# Altium schematic sheet U_Console.SchDoc
size Letter
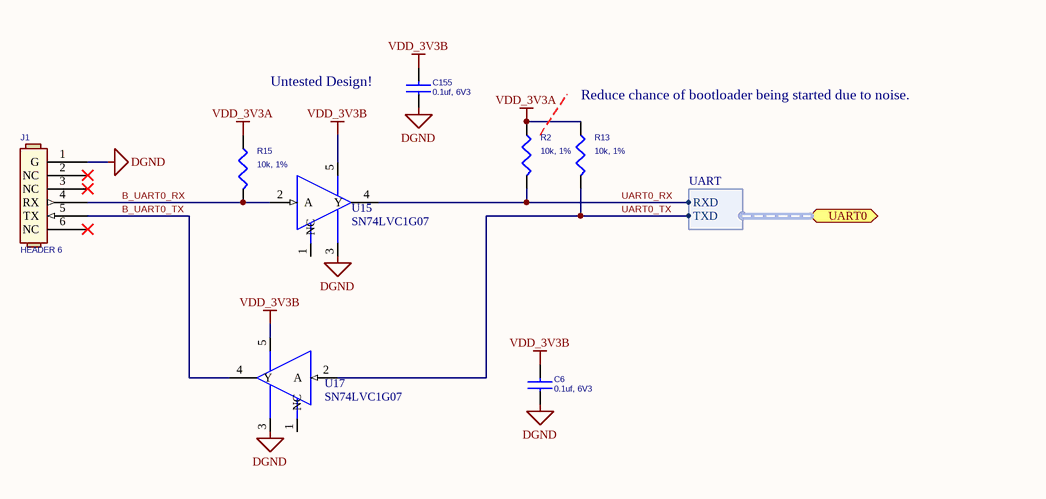
[diagram p0: U_Console.SchDoc]

## Parts
C6  0.1uf, 6V3  [402]
C155  0.1uf, 6V3  [402]
J1  HEADER 6  [SIP6]
R2  10k, 1%  [402]
R13  10k, 1%  [402]
R15  10k, 1%  [402]
U15  SN74LVC1G07  [DCK5_2P15X1P4]
U17  SN74LVC1G07  [DCK5_2P15X1P4]

## Ports
UART0 (harness UART)

## Harnesses
UART: RXD, TXD

## Nets
DGND: C6.1 C155.1 J1.1(G) U15.3(GND) U17.3(GND)
VDD_3V3A: R2.1 R13.1 R15.1
VDD_3V3B: C6.2 C155.2 U15.5(VCC) U17.5(VCC)
B_UART0_RX: J1.4(RX) R15.2 U15.2(A)
B_UART0_TX: J1.5(TX) U17.4(Y)
UART0_RX: R2.2 U15.4(Y) ; port UART0.RXD
UART0_TX: R13.2 U17.2(A) ; port UART0.TXD

Not connected (* = marked no-connect by the designer): J1 2(NC)* 3(NC)* 6(NC)*; U15 1(NC); U17 1(NC)

## Notes on the sheet
- (near C155) Untested Design!
- (near R13) Reduce chance of bootloader being started due to noise.

## Library data of the parts
C6 C155 = CAP_0.1uF_X7R_16V_10% 0402: CAP CER 0.1UF 6.3V 10% X5R 0402; Manufacturer: TDK Corporation; Manufacturer Part Number: C1005X5R0J104K050BA; Capacitance: 0.1µF; Supplier 1: Digi-Key; Supplier Part Number 1: 445-1266-6-ND; RoHS: RoHS Compliant; Category: Capacitors; Stock 1: 127604; Pricing 1: 1=0.1, 10=0.026, 100=0.0121, 250=0.00992, 500=0.00848, 1000=0.0066, 5000=0.0055 (USD); Voltage - Rated: 6.3V; Tolerance: ±10%; Temperature Coefficient: X5R; Mounting Type: Surface Mount, MLCC; Operating Temperature: -55°C ~ 85°C; Applications: General Purpose; Ratings: -; Package / Case: 0402 (1005 Metric); Size / Dimension: 0.039" L x 0.020" W (1.00mm x 0.50mm); Height - Seated (Max): -; Thickness (Max): 0.022" (0.55mm); Lead Spacing: -; Features: -; Packaging: Digi-Reel®; Lead Style: -; ComponentLink1URL: http://product.tdk.com/capacitor/mlcc/en/documents/mlcc_commercial_general_en.pdf; ComponentLink1Description: http://product.tdk.com/capacitor/mlcc/en/documents/mlcc_commercial_general_en.pdf
J1 = HDR_6x1: CONN HEADER 6POS, VERTICAL,  .100 STR TIN; Manufacturer: Samtec Inc; Manufacturer Part Number: FTR-110-03-G-D-06; Connector Type: Unshrouded; Number of Positions: 20; Number of Positions Loaded: 19; Pitch: 0.050" (1.27mm); Row Spacing: 0.100" (2.54mm); Supplier 1: Digi-Key; Supplier Part Number 1: FTR-110-03-G-D-06-ND; RoHS: RoHS Compliant; Category: Connectors, Interconnects; Stock 1: 0; Pricing 1: 1=4.47 (USD); Number of Rows: 2; Contact Mating Length: 0.125" (3.18mm); Mounting Type: Surface Mount; Termination: Solder; Features: -; Contact Finish: Gold; Contact Finish Thickness: 10µin (0.25µm); Color: Black; Packaging: Tube; ComponentLink1URL: http://www.samtec.com/documents/webfiles/cpdf/FTR-1XX-XX-XX-D-X-XX-MKT.pdf; ComponentLink1Description: http://www.samtec.com/documents/webfiles/cpdf/FTR-1XX-XX-XX-D-X-XX-MKT.pdf; Height Stacking (Mating): -; Molding Height Above Board: 0.100" (2.54mm)
R2 R13 R15 = RES_10K_1/16W_1%_0402: RES 10K OHM 1/16W 5% 0402 SMD; Manufacturer: Rohm Semiconductor; Manufacturer Part Number: MCR01MZPJ103; Power (Watts): 0.063W, 1/16W; Temperature Coefficient: ±200ppm/°C; Category: Resistors; ComponentLink1Description: http://rohmfs.rohm.com/en/products/databook/datasheet/passive/resistor/chip_resistor/mcr_a.pdf; ComponentLink1URL: http://rohmfs.rohm.com/en/products/databook/datasheet/passive/resistor/chip_resistor/mcr_a.pdf; Composition: Thick Film; Features: Automotive AEC-Q200 Qualified; Height: 0.016" (0.40mm); Number of Terminations: 2; Package / Case: 0402 (1005 Metric); Packaging: Digi-Reel®; Pricing 1: 1=0.1, 10=0.019, 25=0.014, 100=0.0078, 250=0.00596, 500=0.00476, 1000=0.0035, 5000=0.00251 (USD); Resistance (Ohms): 10k; RoHS: RoHS Compliant; Size / Dimension: 0.039" L x 0.020" W (1.00mm x 0.50mm); Stock 1: 110842; Supplier 1: Digi-Key; Supplier Device Package: 0402 (1005 Metric); Supplier Part Number 1: RHM10KJDKR-ND; Tolerance: ±5%
U15 U17 = SN74LVC1G07DCK: IC BUFFER SINGLE 1INPUT SC705; Manufacturer: Texas Instruments; Manufacturer Part Number: SN74LVC1G06DCKTG4; Logic Type: Inverter, Buffer; Number of Circuits: 1; Voltage - Supply: 1.65 V ~ 5.5 V; Current - Quiescent (Max): 10µA; Current - Output High, Low: -, 32mA; Logic Level - Low: 0.7 V ~ 0.8 V; Logic Level - High: 1.7 V ~ 2 V; Max Propagation Delay @ V, Max CL: 3ns @ 5V, 50pF; Supplier 1: Digi-Key; Supplier Part Number 1: SN74LVC1G07DCKTG4-ND; RoHS: RoHS Compliant; Category: Integrated Circuits (ICs); Stock 1: 0; Pricing 1: 1250=0.32 (USD); Number of Inputs: 1; Features: Open Drain; Operating Temperature: -40°C ~ 85°C; Mounting Type: Surface Mount; Supplier Device Package: SC-70-5; Package / Case: 6-TSSOP (5 Lead), SC-88A, SOT-353; Packaging: Tape & Reel (TR); ComponentLink1URL: http://www.ti.com/lit/ds/symlink/sn74lvc1g06.pdf; ComponentLink1Description: http://www.ti.com/lit/ds/symlink/sn74lvc1g06.pdf